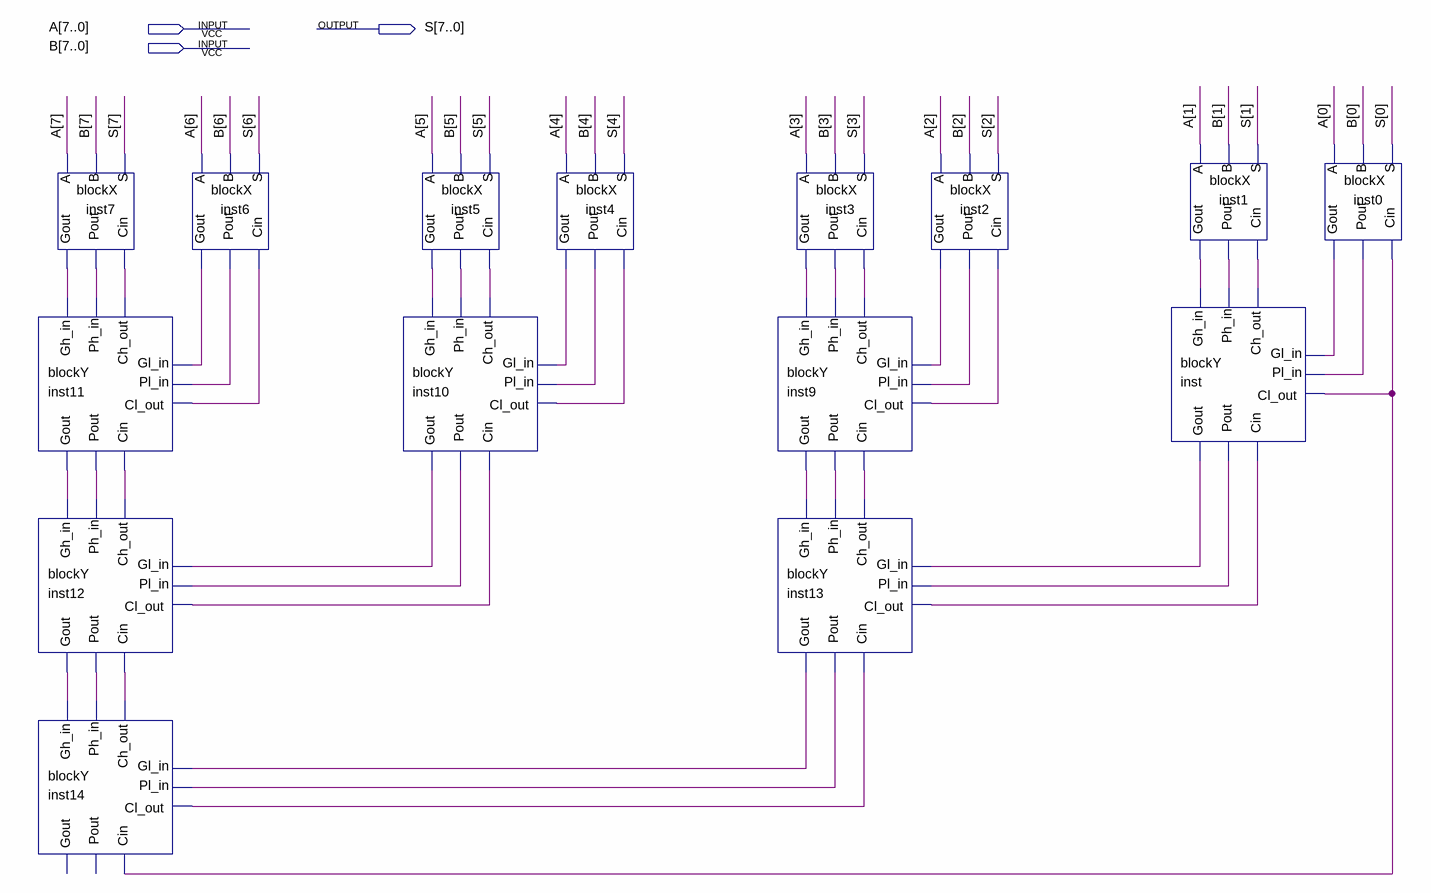
[diagram p0: schematic sheet]
// Quartus schematic lookahead.bdf as structural Verilog: 15 symbols, 3 pins
module lookahead (
  input  [7:0] A,
  input  [7:0] B,
  output [7:0] S
);

  wire inst0_gout, inst0_pout, inst1_gout, inst1_pout, inst2_gout, inst2_pout, inst3_gout, inst3_pout,
       inst4_gout, inst4_pout, inst5_gout, inst5_pout, inst6_gout, inst6_pout, inst7_gout, inst7_pout,
       inst9_ch_out, inst9_cl_out, inst9_gout, inst9_pout, inst10_ch_out, inst10_cl_out, inst10_gout,
       inst10_pout, inst11_ch_out, inst11_cl_out, inst11_gout, inst11_pout, inst12_ch_out, inst12_cl_out,
       inst12_gout, inst12_pout, inst13_ch_out, inst13_cl_out, inst13_gout, inst13_pout, inst14_ch_out,
       inst14_cl_out, inst_ch_out, inst_cl_out, inst_gout, inst_pout;

  blockX inst7 (.A(A[7]), .B(B[7]), .Cin(inst11_ch_out), .S(S[7]), .Gout(inst7_gout), .Pout(inst7_pout));
  blockY inst11 (
    .Gh_in(inst7_gout), .Ph_in(inst7_pout), .Gl_in(inst6_gout), .Pl_in(inst6_pout), .Cin(inst12_ch_out),
    .Ch_out(inst11_ch_out), .Cl_out(inst11_cl_out), .Pout(inst11_pout), .Gout(inst11_gout));
  blockY inst12 (
    .Gh_in(inst11_gout), .Ph_in(inst11_pout), .Gl_in(inst10_gout), .Pl_in(inst10_pout), .Cin(inst14_ch_out),
    .Ch_out(inst12_ch_out), .Cl_out(inst12_cl_out), .Pout(inst12_pout), .Gout(inst12_gout));
  blockY inst14 (
    .Gh_in(inst12_gout), .Ph_in(inst12_pout), .Gl_in(inst13_gout), .Pl_in(inst13_pout), .Cin(inst_cl_out),
    .Ch_out(inst14_ch_out), .Cl_out(inst14_cl_out));  // open: Pout, Gout
  blockX inst6 (.A(A[6]), .B(B[6]), .Cin(inst11_cl_out), .S(S[6]), .Gout(inst6_gout), .Pout(inst6_pout));
  blockX inst5 (.A(A[5]), .B(B[5]), .Cin(inst10_ch_out), .S(S[5]), .Gout(inst5_gout), .Pout(inst5_pout));
  blockY inst10 (
    .Gh_in(inst5_gout), .Ph_in(inst5_pout), .Gl_in(inst4_gout), .Pl_in(inst4_pout), .Cin(inst12_cl_out),
    .Ch_out(inst10_ch_out), .Cl_out(inst10_cl_out), .Pout(inst10_pout), .Gout(inst10_gout));
  blockX inst4 (.A(A[4]), .B(B[4]), .Cin(inst10_cl_out), .S(S[4]), .Gout(inst4_gout), .Pout(inst4_pout));
  blockY inst9 (
    .Gh_in(inst3_gout), .Ph_in(inst3_pout), .Gl_in(inst2_gout), .Pl_in(inst2_pout), .Cin(inst13_ch_out),
    .Ch_out(inst9_ch_out), .Cl_out(inst9_cl_out), .Pout(inst9_pout), .Gout(inst9_gout));
  blockY inst13 (
    .Gh_in(inst9_gout), .Ph_in(inst9_pout), .Gl_in(inst_gout), .Pl_in(inst_pout), .Cin(inst14_cl_out),
    .Ch_out(inst13_ch_out), .Cl_out(inst13_cl_out), .Pout(inst13_pout), .Gout(inst13_gout));
  blockX inst3 (.A(A[3]), .B(B[3]), .Cin(inst9_ch_out), .S(S[3]), .Gout(inst3_gout), .Pout(inst3_pout));
  blockX inst2 (.A(A[2]), .B(B[2]), .Cin(inst9_cl_out), .S(S[2]), .Gout(inst2_gout), .Pout(inst2_pout));
  blockX inst1 (.A(A[1]), .B(B[1]), .Cin(inst_ch_out), .S(S[1]), .Gout(inst1_gout), .Pout(inst1_pout));
  blockY inst (
    .Gh_in(inst1_gout), .Ph_in(inst1_pout), .Gl_in(inst0_gout), .Pl_in(inst0_pout), .Cin(inst13_cl_out),
    .Ch_out(inst_ch_out), .Cl_out(inst_cl_out), .Pout(inst_pout), .Gout(inst_gout));
  blockX inst0 (.A(A[0]), .B(B[0]), .Cin(inst_cl_out), .S(S[0]), .Gout(inst0_gout), .Pout(inst0_pout));
endmodule
